# EAGLE design shredmaster (EAGLE 8.2.0)
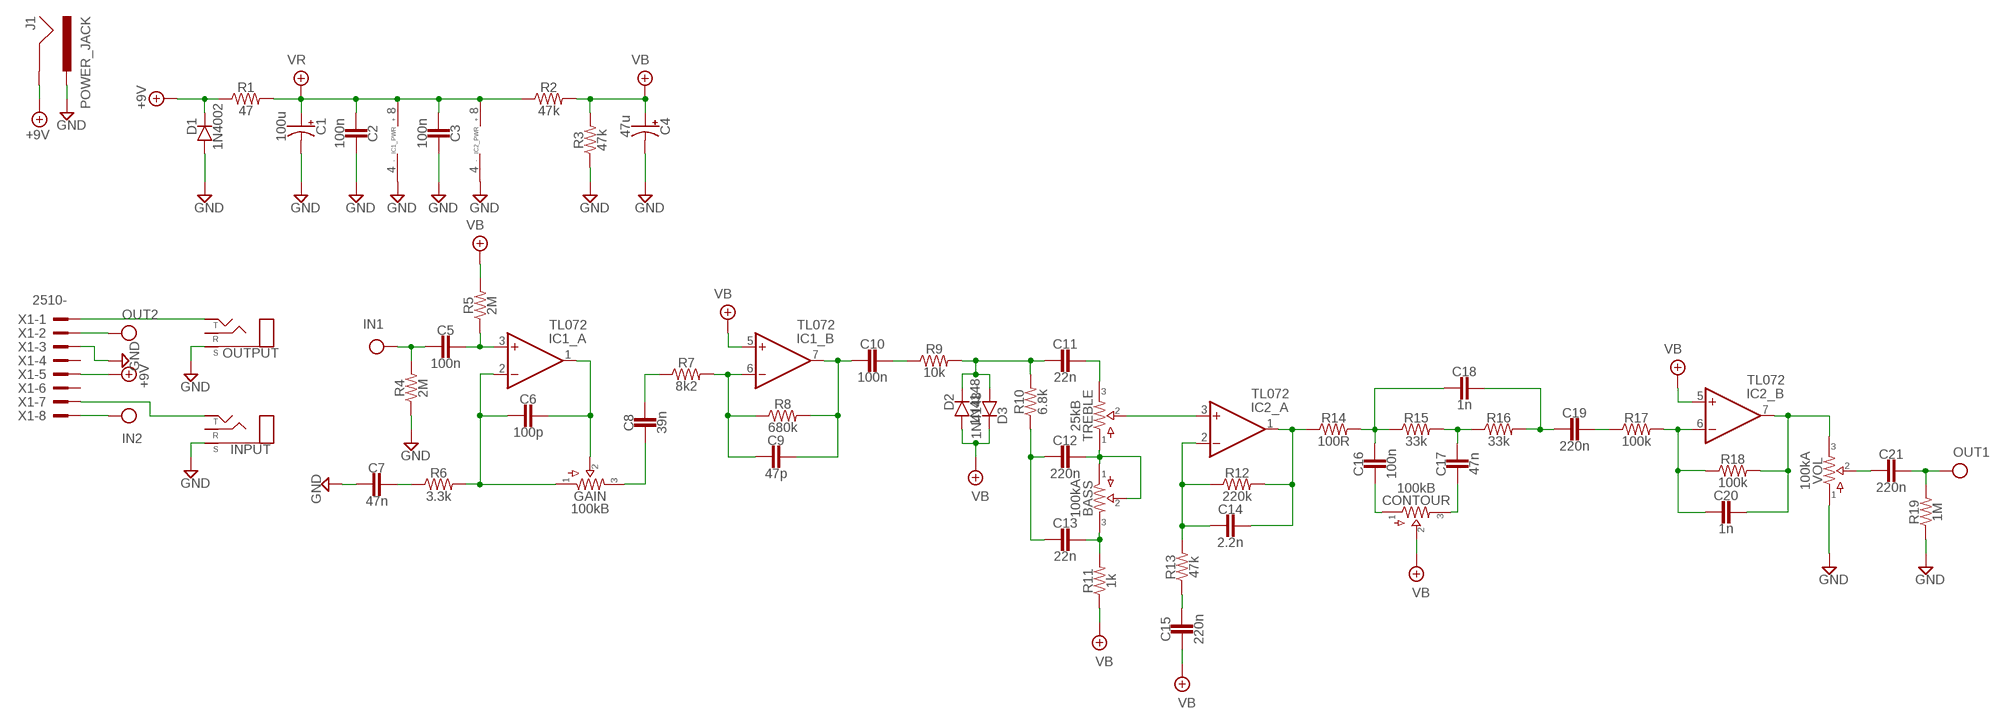
[diagram p0: schematic, sheet 1]

## Parts
BASS  100kA  POTS16MM  [16MM]
C1  100u  0400  [040_020]
C2  100n  CER/FILM2  [050X030_025_2]
C3  100n  CER/FILM2  [050X030_025_2]
C4  47u  0400  [040_020]
C5  100n  CER/FILMBOX.1  [BOX_SMALL]
C6  100p  CER/FILM2  [050X030_025_2]
C7  47n  CER/FILMBOX.1  [BOX_SMALL]
C8  39n  CER/FILMBOX.1  [BOX_SMALL]
C9  47p  CER/FILM2  [050X030_025_2]
C10  100n  CER/FILMBOX.1  [BOX_SMALL]
C11  22n  CER/FILMBOX.1  [BOX_SMALL]
C12  220n  CER/FILMBOX.1  [BOX_SMALL]
C13  22n  CER/FILMBOX.1  [BOX_SMALL]
C14  2.2n  CER/FILMBOX.1  [BOX_SMALL]
C15  220n  CER/FILMBOX.1  [BOX_SMALL]
C16  100n  CER/FILMBOX.1  [BOX_SMALL]
C17  47n  CER/FILMBOX.1  [BOX_SMALL]
C18  1n  CER/FILMBOX.1  [BOX_SMALL]
C19  220n  CER/FILMBOX.1  [BOX_SMALL]
C20  1n  CER/FILMBOX.1  [BOX_SMALL]
C21  220n  CER/FILMBOX.1  [BOX_SMALL]
CONTOUR  100kB  POTS16MM  [16MM]
D1  1N4002  DO41.2  [DO41-2]
D2  1N4148  DO35.2  [DO35-2]
D3  1N4148  DO35.2  [DO35-2]
GAIN  100kB  POTS16MM  [16MM]
IC1  TL072  DUALTH  [DIL08]
IC2  TL072  DUALTH  [DIL08]
INPUT  STEREONMJ  [NMJ6HCD2]
J1  POWER_JACK  [POWER_JACK_PTH]
OUTPUT  STEREONMJ  [NMJ6HCD2]
R1  47  R_.3B  [R0207/3]
R2  47k  R_.3B  [R0207/3]
R3  47k  R_.3B  [R0207/3]
R4  2M  R_.3B  [R0207/3]
R5  2M  R_.3B  [R0207/3]
R6  3.3k  R_.3B  [R0207/3]
R7  8k2  R_.3B  [R0207/3]
R8  680k  R_.3B  [R0207/3]
R9  10k  R_.3B  [R0207/3]
R10  6.8k  R_.3B  [R0207/3]
R11  1k  R_.3B  [R0207/3]
R12  220k  R_.3B  [R0207/3]
R13  47k  R_.3B  [R0207/3]
R14  100R  R_.3B  [R0207/3]
R15  33k  R_.3B  [R0207/3]
R16  33k  R_.3B  [R0207/3]
R17  100k  R_.3B  [R0207/3]
R18  100k  R_.3B  [R0207/3]
R19  1M  R_.3B  [R0207/3]
TREBLE  25kB  POTS16MM  [16MM]
VOL  100kA  POTS16MM  [16MM]
X1  2510-  [PAK100/2500-10]

## Nets
+9V: D1.C J1.GND R1.1 X1.5
GND: C1.- C2.1 C3.1 C4.- C7.2 D1.A IC1.4(_PWR:V-) IC2.4(_PWR:V-) INPUT.S J1.PWR OUTPUT.S R3.1 R4.1 R19.1 VOL.1 X1.3
IN: C5.2 R4.2 X1.8
N$1: INPUT.T X1.7
N$2: C5.1 IC1.3(_A:+IN) R5.1
N$3: C6.1 GAIN.2 IC1.1(_A:OUT)
N$4: OUTPUT.T X1.1
N$5: C6.2 GAIN.1 IC1.2(_A:-IN) R6.2
N$6: C7.1 R6.1
N$7: C8.2 GAIN.3
N$8: C8.1 R7.1
N$9: C9.2 IC1.6(_B:-IN) R7.2 R8.1
N$10: C9.1 C10.2 IC1.7(_B:OUT) R8.2
N$11: C10.1 R9.1
N$12: C11.2 D2.C D3.A R9.2 R10.2
N$13: C11.1 TREBLE.3
N$14: C12.2 C13.2 R10.1
N$15: BASS.1 BASS.2 C12.1 TREBLE.1
N$16: BASS.3 C13.1 R11.2
N$17: C21.2 VOL.2
N$18: C14.2 IC2.2(_A:-IN) R12.1 R13.2
N$20: C14.1 IC2.1(_A:OUT) R12.2 R14.1
N$21: IC2.3(_A:+IN) TREBLE.2
N$22: C15.1 R13.1
N$23: C16.2 CONTOUR.1
N$24: C17.2 CONTOUR.3
N$25: C16.1 C18.2 R14.2 R15.1
N$26: C17.1 R15.2 R16.1
N$27: C18.1 C19.2 R16.2
N$28: C19.1 R17.1
N$30: C20.2 IC2.6(_B:-IN) R17.2 R18.1
N$31: C20.1 IC2.7(_B:OUT) R18.2 VOL.3
OUT: C21.1 R19.2 X1.2
VB: C4.+ C15.2 CONTOUR.2 D2.A D3.C IC1.5(_B:+IN) IC2.5(_B:+IN) R2.2 R3.2 R5.2 R11.1
VR: C1.+ C2.2 C3.2 IC1.8(_PWR:V+) IC2.8(_PWR:V+) R1.2 R2.1
Unconnected: INPUT.R OUTPUT.R X1.4 X1.6

## Library data of the parts
BASS CONTOUR GAIN TREBLE VOL = pedals-potentiometers:POTS
C1 C4 = pedals-capacitors-elec:040
C2 C3 C5-C21 = pedals-capacitors-film:CER/FILM: 47 - 120pF Xicon Ceramic Disc 2.5mm lead spacing
D1 = pedals-diodes:DO41: DO-41 Package Diodes: 1N4001 - 1N40019 Zener Diodes: 1N4728 - 1N4764
D2 D3 = pedals-diodes:DO35: DO-35 Package Diodes: 1N914
IC1 IC2 = pedals-integrated circuits:DUAL: OP AMP
INPUT OUTPUT = pedals-jacks:STEREO
J1 = pedals-jacks:POWER_JACK: Power Jack Connector This is the standard 5.5mm barrel jack for power. The PTH is the most common, proven, reliable, footprint. The Slot footprint only works if the mill layer is transmitted to the PCB fab house so be warned. Here are the connectors we sell at SparkFun: DC Barrel Power Jack/Connector <https://www.sparkfun.com/products/119> (PRT-00119) DC Barrel Power Jack/Connector (SMD) <https://www.sparkfun.com/products/12748> (PRT-12748) DC Barrel Jack Adapter - Breadboard Compatible <https://www.sparkfun.com/products/10811> (PRT-10811) It is used on this SparkFun product (and many, many others): SparkFun RedBoard - Programmed with Arduino <https://www.sparkfun.com/products/12757> (DEV-12757) Also, if you need a mating power supply or connector, please check these out: Wall Adapter Power Supply - 9VDC 650mA <https://www.sparkfun.com/products/298> (TOL-00298) DC Barrel Jack Adapter - Male <https://www.sparkfun.com/products/10287> (PRT-10287); PROD_ID: CONN-08197
R1-R19 = pedals-resistors:R_
X1 = pedals-headers:2510-: 3M (TM) Pak 100 4-Wall Header Source: 3M; MF: 3M; MPN: 2510-6002UB; OC_FARNELL: 9838244; OC_NEWARK: 46F4725

## Board
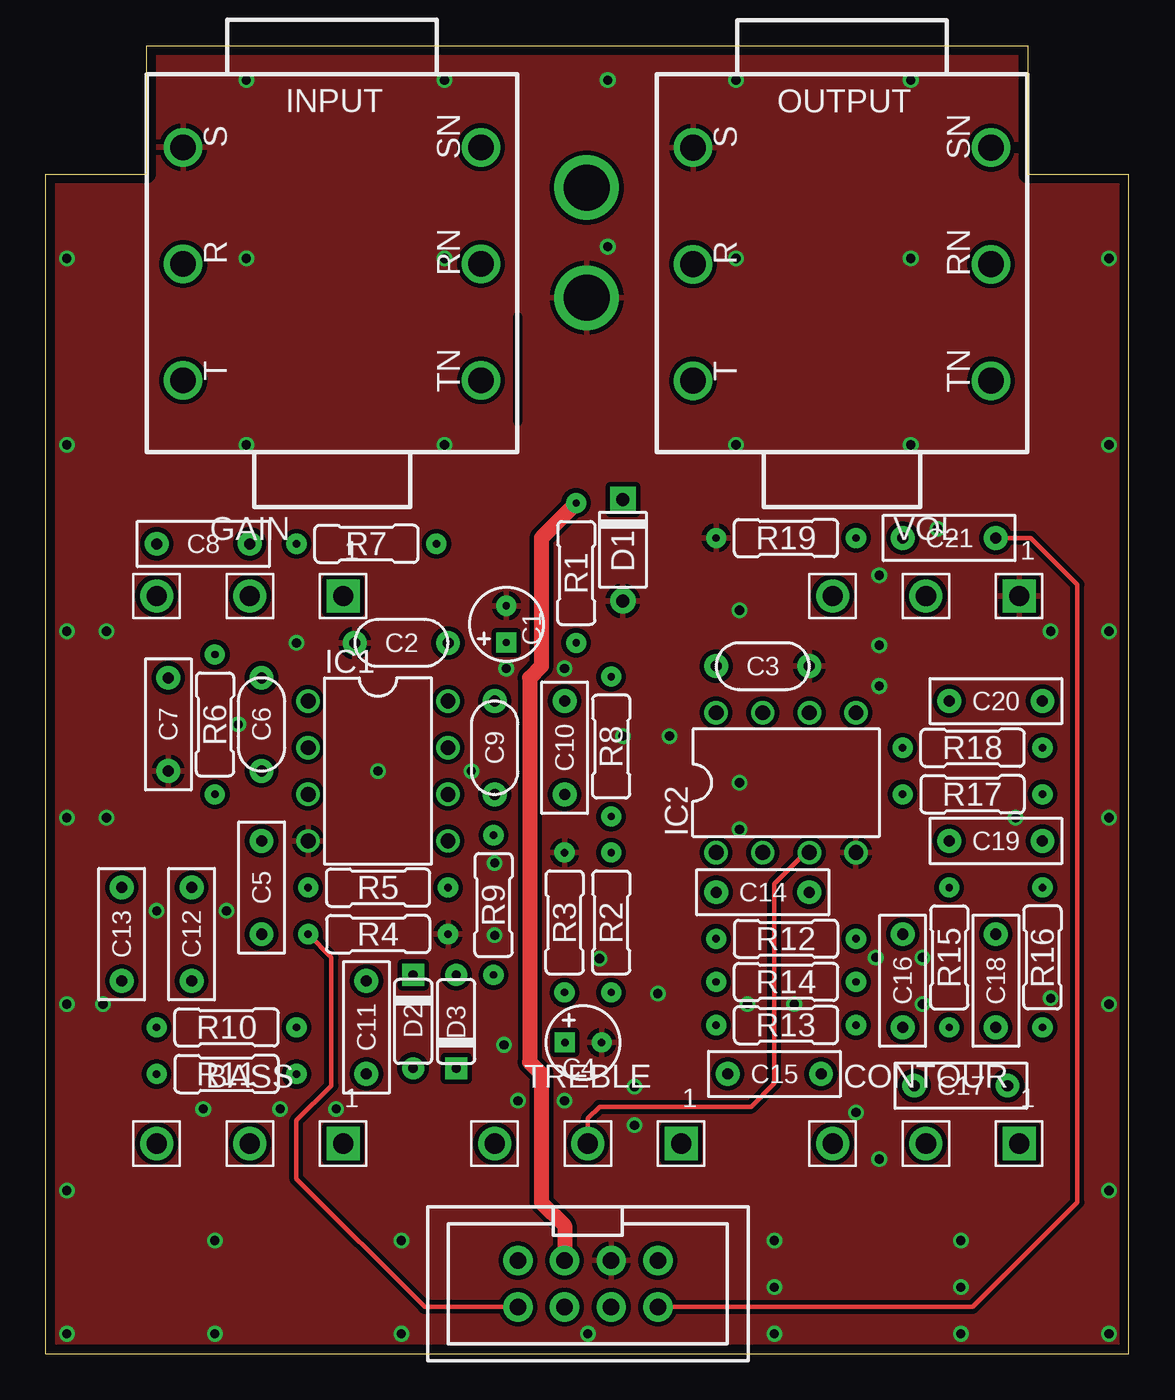
[diagram p1: board, top side]
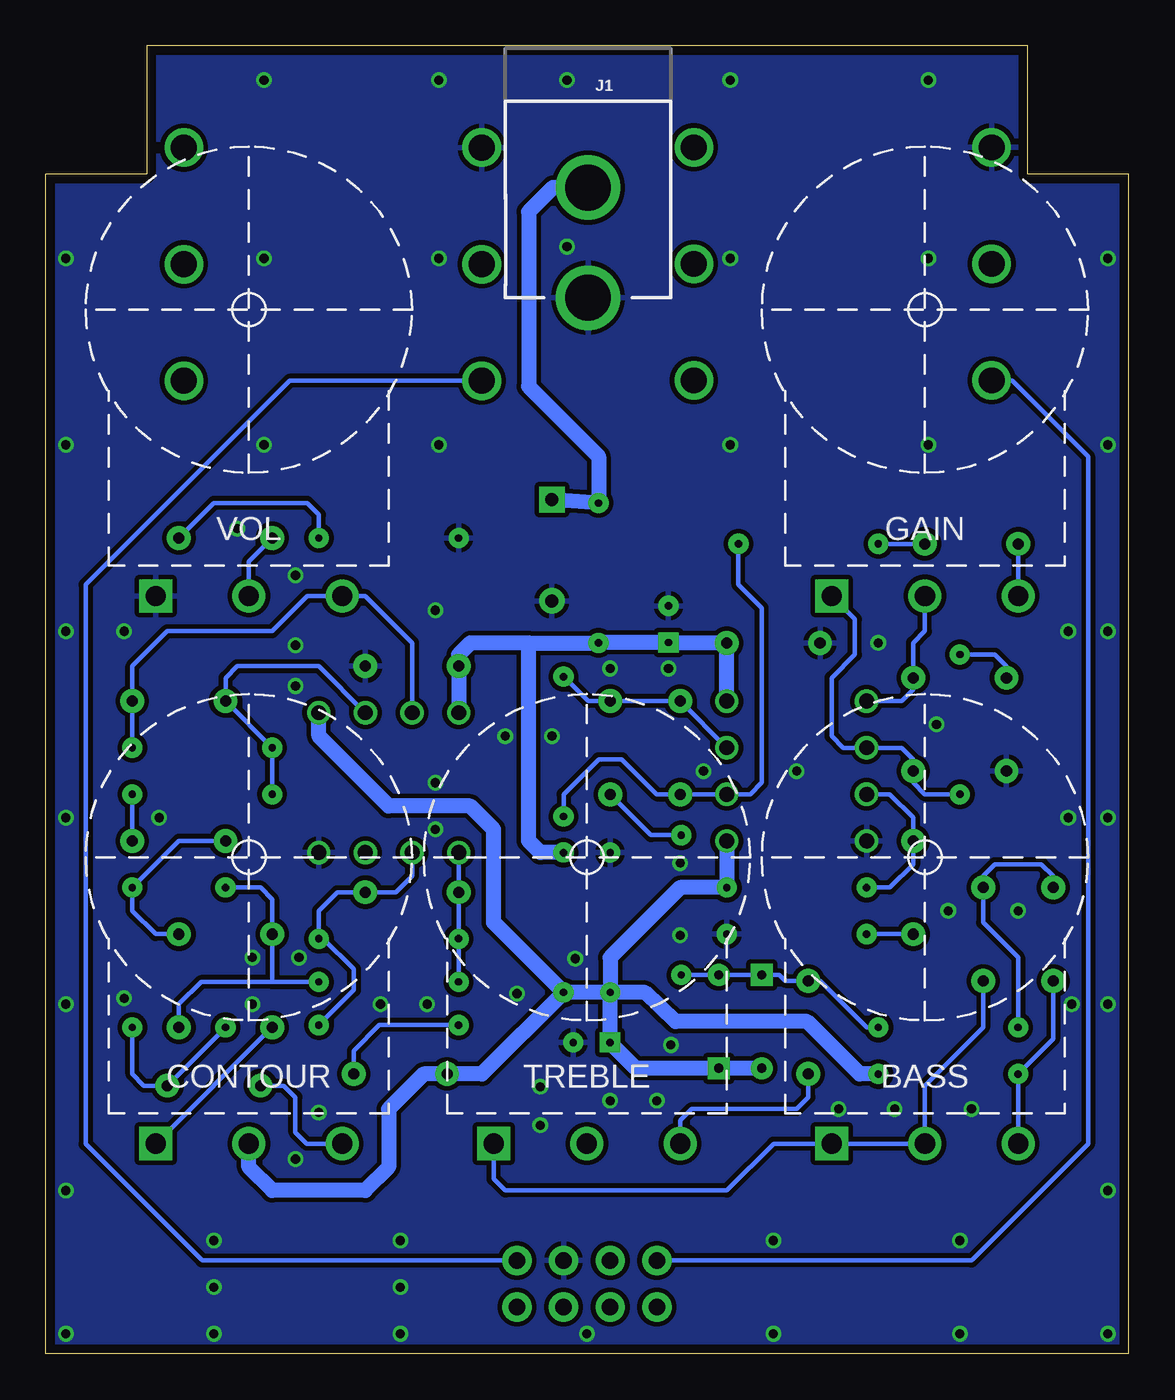
[diagram p2: board, bottom side, seen from below]

Size 59 x 71.27 mm. Coordinates in mm from the lower left corner, seen from the top.
Copper layers (1*16): Top 0.035mm / dielectric 1.6mm / Bottom 0.035mm
Design rules "Elecrow_2-layer_PCB_eagle_rule": minimum track width 6mil, minimum drill 12mil, track to track 6mil, track to pad 6mil, pad to pad 6mil, via to via 8mil, smd to smd 0mil, copper to edge 20mil, drill to drill 10mil, minimum pad ring 6mil, minimum via ring 6mil, stop-mask expansion 0mil, vias tented up to drill 100mil, thermal gap 10mil
tRestrict: 1 lines

### Footprints (pad centres in the part's own frame; a part is rotated, then mirrored left to right if it is on the bottom)
16MM = drill 1.1 pad 1.8 square: 1 5.08,-1 | drill 1.1 pad 1.8: 2 0,-1; 3 -5.08,-1
040_020 = drill 0.4 pad 1.1 square: + -1.001,0 | drill 0.4 pad 1.1: - 1.001,0
050X030_025_2 = drill 0.6 pad 1.3: 1 -2.54,0; 2 2.54,0
BOX_SMALL = drill 0.6 pad 1.3: 1 -2.54,0; 2 2.54,0
DO41-2 = drill 0.7 pad 1.4: A 2.794,0 | drill 0.7 pad 1.4 square: C -2.731,0
DO35-2 = drill 0.5 pad 1.2: A 2.54,0 | drill 0.5 pad 1.2 square: C -2.54,0
DIL08 = drill 0.813 pad 1.27: 1 -3.81,-3.81; 2 -1.27,-3.81; 3 1.27,-3.81; 4 3.81,-3.81; 5 3.81,3.81; 6 1.27,3.81; 7 -1.27,3.81; 8 -3.81,3.81
NMJ6HCD2 = drill 1.4: R 0,8.115; RN 0,-8.115; S 6.35,8.115; SN 6.35,-8.115; T -6.35,8.115; TN -6.35,-8.115
POWER_JACK_PTH = drill 2.5: GND 0,7.7; PWR 0,13.7
R0207/3 = drill 0.4 pad 1.1: 1 -3.81,0; 2 3.81,0
PAK100/2500-10 = drill 0.9 pad 1.6: 1 -3.81,-1.27; 2 -3.81,1.27; 3 -1.27,-1.27; 4 -1.27,1.27; 5 1.27,-1.27; 6 1.27,1.27; 7 3.81,-1.27; 8 3.81,1.27

### Placement (x,y rotation side)
BASS  11.11,12.45 0 top
C1  25.08,39.75 90 top
C2  19.37,38.74 0 top
C3  39.05,37.47 180 top
C4  29.27,16.95 0 top
C5  11.75,25.4 270 top
C6  11.75,34.29 270 top
C7  6.67,34.29 270 top
C8  8.57,44.13 180 top
C9  24.45,33.02 270 top
C10  28.26,33.02 90 top
C11  17.46,17.78 90 top
C12  7.94,22.86 90 top
C13  4.13,22.86 90 top
C14  39.05,25.15 0 top
C15  39.69,15.24 180 top
C16  46.67,20.32 270 top
C17  49.85,14.61 180 top
C18  51.75,20.32 270 top
C19  51.75,27.94 180 top
C20  51.75,35.56 180 top
C21  49.21,44.45 180 top
CONTOUR  47.94,12.45 0 top
D1  31.43,43.82 270 top
D2  20,18.1 270 top
D3  22.35,18.1 90 top
GAIN  11.11,42.29 0 top
IC1  18.1,31.75 270 top
IC2  40.32,31.11 0 top
INPUT  15.59,59.39 90 top
J1  29.46,71.25 180 bottom
OUTPUT  43.37,59.37 90 top
R1  28.89,42.55 270 top
R2  30.8,23.5 270 top
R3  28.26,23.5 270 top
R4  18.1,22.86 180 top
R5  18.1,25.4 0 top
R6  9.21,34.29 270 top
R7  17.46,44.13 0 top
R8  30.8,33.08 90 top
R9  24.38,24.45 270 top
R10  9.84,17.78 0 top
R11  9.84,15.24 180 top
R12  40.32,22.61 180 top
R13  40.32,17.91 0 top
R14  40.32,20.26 0 top
R15  49.21,21.59 270 top
R16  54.29,21.59 90 top
R17  50.48,30.48 180 top
R18  50.48,33.02 0 top
R19  40.32,44.45 0 top
TREBLE  29.53,12.45 0 top
U$1  [125B_PCB]  0,1.27 0 top
VOL  47.94,42.29 0 top
X1  29.53,3.81 180 top

### Tracks (layer width: path | path; a pad name or v marks a point on that pad's centre or on a via)
+9V
  Top 0.813: R1.1 26.99,44.45 26.99,37.47 26.35,36.83 26.35,15.88 26.99,15.24 26.99,8.26 28.26,6.98 X1.5
  Bottom 0.813: J1.GND 31.39,63.55 32.7,62.23 32.7,52.71 28.89,48.9 R1.1 D1.C
GND  (via drill 0.5 pad 0.85)
  other vias: 57.91,59.69 57.91,49.53 10.92,69.41 21.72,69.41 30.61,69.41 1.14,49.53 10.92,59.69 10.92,49.53 21.72,59.69 21.72,49.53 30.61,60.33 37.59,69.41 47.12,69.41 37.59,59.69 37.59,49.53 47.12,59.69 47.12,49.53 57.91,39.37 57.91,29.21 57.91,19.05 57.91,8.89 57.91,1.08 49.85,1.08 39.69,1.08 29.53,1.08 19.37,1.08 9.21,1.08 1.14,1.08 1.14,59.69 1.14,39.37 1.14,29.21 1.14,19.05 1.14,8.89 19.37,6.16 39.69,3.62 49.85,3.62 54.74,19.37 52.83,29.21 54.74,39.37 45.4,10.6 44.13,13.14 28.26,13.78 25.72,13.78 32.07,12.45 32.07,14.54 33.34,19.62 30.16,21.53 24.45,22.8 24.96,16.83 15.81,13.33 12.76,13.33 9.21,6.16 39.69,6.16 49.85,6.16 8.57,13.33 6.03,24.13 9.84,24.13 10.48,34.29 18.1,31.75 13.65,38.74 47.75,19.05 47.75,21.59 45.21,21.59 40.77,19.05 38.23,19.05 37.78,28.57 37.78,31.11 31.43,33.66 33.97,33.66 45.4,36.39 45.4,38.61 48.58,44.96 45.4,42.42 37.78,40.51 25.08,37.34 28.26,37.34 23.18,31.75 24.45,26.73 3.3,39.37 3.3,29.21 3.11,19.05
  pour Top (isolate 0.254): 0.32,0 59.37,0 59.37,71.12 -0.32,71.12 -0.32,0
  pour Bottom (isolate 0.254): 0.32,71.12 59.37,71.12 58.74,-1.27 0.32,-1.27
IN
  Top 0.254: X1.8 20.64,2.54 13.65,9.53 13.65,12.7 15.56,14.61 15.56,21.59 R4.2
  Bottom 0.254: C5.2 R4.2
N$1
  Bottom 0.254: INPUT.T 6.37,53.04 2.22,48.9 2.22,11.43 8.57,5.08 X1.7
N$2
  Bottom 0.254: R5.1 13.02,25.4 11.75,26.67 C5.1 11.75,29.21 13.02,30.48 IC1.3
N$3
  Bottom 0.254: IC1.1 12.38,35.56 11.75,36.2 C6.1 11.75,38.74 11.11,39.37 GAIN.2
N$4
  Bottom 0.254: X1.1 50.48,5.08 56.83,11.43 56.83,41.91 45.72,53.02 OUTPUT.T
N$5
  Bottom 0.254: GAIN.1 14.92,40.02 14.92,38.1 16.19,36.83 16.19,33.66 15.56,33.02 IC1.2 12.38,33.02 11.75,32.38 C6.2 11.75,31.11 11.11,30.48 R6.2
N$6
  Bottom 0.254: R6.1 7.3,38.1 6.67,37.47 C7.1
N$7
  Bottom 0.254: C8.2 GAIN.3
N$8
  Bottom 0.254: R7.1 C8.1
N$9
  Bottom 0.254: R7.2 21.27,41.91 20,40.64 20,31.11 20.64,30.48 IC1.6 C9.2 25.72,30.48 27.62,32.38 28.89,32.38 30.8,30.48 R8.1
N$10
  Bottom 0.254: IC1.7 C9.1 C10.2 29.46,35.56 R8.2
N$11
  Bottom 0.254: R9.1 26.03,28.26 C10.1
N$12
  Bottom 0.254: R10.2 14.29,17.78 16.83,20.32 C11.2 18.73,20.32 19.05,20.64 D2.C D3.A R9.2
N$13
  Bottom 0.254: TREBLE.3 24.45,12.7 23.81,13.33 18.1,13.33 17.46,13.97 C11.1
N$14
  Bottom 0.254: R10.1 6.03,21.59 7.94,23.5 C12.2 7.94,26.04 7.3,26.67 4.76,26.67 4.13,26.04 C13.2
N$15
  Bottom 0.254: C12.1 7.94,17.78 11.11,14.61 BASS.2 BASS.1 19.35,11.45 21.91,8.89 33.97,8.89 34.61,9.53 TREBLE.1
N$16
  Bottom 0.254: C13.1 4.13,17.14 R11.2 BASS.3
N$17
  Bottom 0.254: VOL.2 47.94,43.18 C21.2
N$18
  Bottom 0.254: IC2.2 39.05,26.04 39.94,25.15 C14.2 43.12,25.15 44.13,24.13 R12.1 43.88,22.61 42.23,20.95 42.23,19.81 R13.2
N$20
  Bottom 0.254: R14.1 R12.2 C14.1 IC2.1
N$21
  Top 0.254: IC2.3 41.4,27.3 39.69,25.59 39.69,14.73 38.42,13.46 30.16,13.46 29.53,12.83 TREBLE.2
N$22
  Bottom 0.254: R13.1 40.83,17.91 42.23,16.51 C15.1
N$23
  Bottom 0.254: 53.01,11.45 CONTOUR.1 46.69,17.78 C16.2
N$24
  Bottom 0.254: CONTOUR.3 44.78,11.45 45.4,12.06 45.4,13.97 46.04,14.61 C17.2
N$25
  Bottom 0.254: R15.1 47.31,25.4 46.67,24.77 C16.1 46.67,20.26 | 46.67,20.26 R14.2 | 46.67,20.26 50.55,20.26 51.75,19.05 C18.2
N$26
  Bottom 0.254: R15.2 C17.1 53.66,14.61 54.29,15.24 R16.1
N$27
  Bottom 0.254: C18.1 53.02,22.86 54.29,24.13 R16.2 51.75,27.94 C19.2
N$28
  Bottom 0.254: C19.1 R17.1
N$30
  Bottom 0.254: R17.2 R18.1 C20.2 49.21,36.83 48.58,37.47 44.13,37.47 IC2.6
N$31
  Bottom 0.254: IC2.7 39.05,38.74 41.59,41.28 42.85,41.28 VOL.3 44.75,41.29 46.67,39.37 52.39,39.37 54.29,37.47 C20.1 R18.2
OUT
  Top 0.254: X1.2 50.48,2.54 56.2,8.26 56.2,41.91 53.66,44.45 C21.1
  Bottom 0.254: R19.2 44.13,45.72 44.77,46.36 49.85,46.36 C21.1
VB
  Bottom 0.813: IC1.5 R5.2 24.45,25.4 28.26,21.59 R3.2 | CONTOUR.2 47.94,10.16 46.67,8.89 41.59,8.89 40.32,10.16 40.32,13.33 38.42,15.24 C15.2 35.24,15.24 R2.2 | D2.A D3.C 26.88,15.56 C4.+ 28.27,19.67 R3.2 | R3.2 R2.2 | R11.1 14.67,15.24 17.53,18.1 24.7,18.1 26.35,19.68 R3.2 | IC2.5 44.13,33.66 40.32,29.84 35.88,29.84 34.61,28.57 34.61,23.5 R2.2
VR
  Bottom 0.813: IC1.8 C2.2 25.07,38.74 C1.+ 28.88,38.75 R1.2 32.7,38.74 | R2.1 32.07,27.3 32.7,27.94 32.7,38.74 | 32.7,38.74 35.88,38.74 36.51,38.1 C3.2 IC2.8